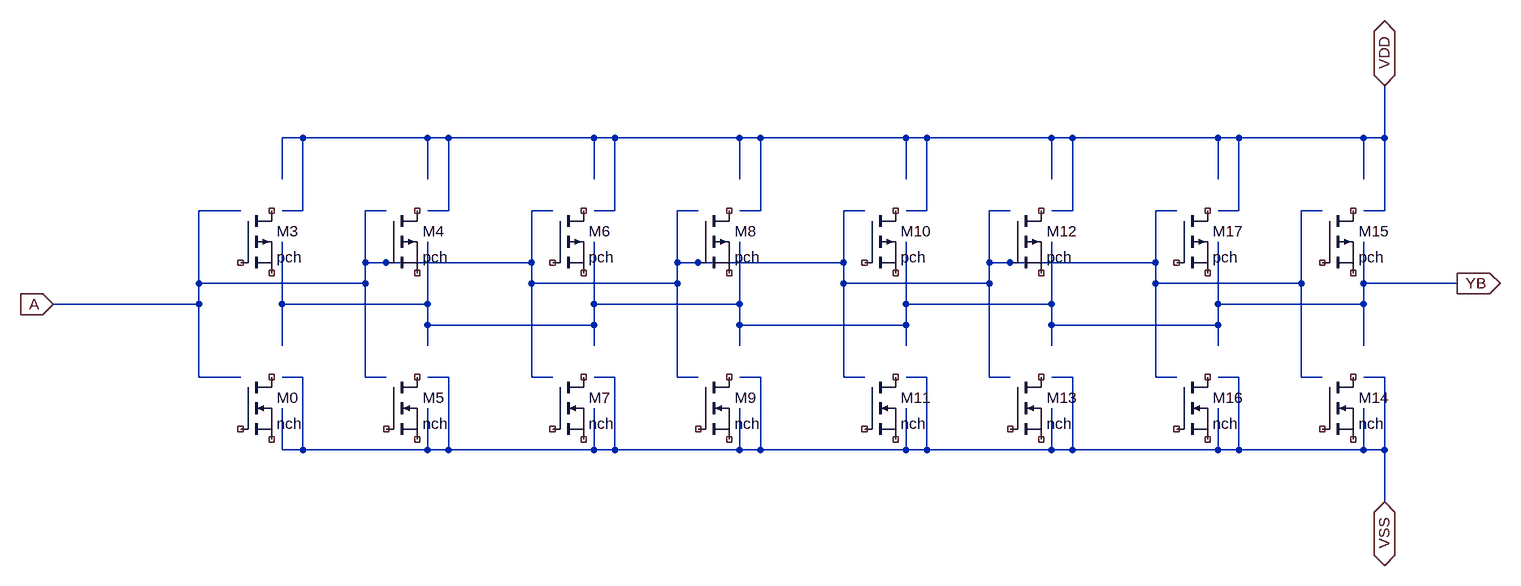
[diagram p0: schematic inv8.asc]
inv8.asc, the LTspice schematic file:
Version 4
SHEET 1 2336 832
WIRE 2112 400 2112 336
WIRE 1888 432 1888 336
WIRE 1888 464 1888 432
WIRE 1888 496 1888 464
WIRE 1632 464 1632 432
WIRE 2112 432 2112 400
WIRE 2112 496 2112 432
WIRE 1408 432 1632 432
WIRE 1408 432 1408 336
WIRE 1408 464 1408 432
WIRE 1408 496 1408 464
WIRE 1632 464 1888 464
WIRE 1152 464 1152 432
WIRE 1632 432 1632 336
WIRE 1888 432 2112 432
WIRE 1632 496 1632 464
WIRE 1152 432 1152 336
WIRE 928 432 928 336
WIRE 928 432 1152 432
WIRE 672 464 928 464
WIRE 672 496 672 464
WIRE 928 464 928 432
WIRE 928 496 928 464
WIRE 1152 496 1152 464
WIRE 448 432 448 336
WIRE 448 432 672 432
WIRE 672 432 672 336
WIRE 672 464 672 432
WIRE 2112 400 2256 400
WIRE 448 496 448 432
WIRE 1152 464 1408 464
WIRE 1792 544 1792 400
WIRE 1536 368 1536 288
WIRE 1792 368 1792 288
WIRE 1792 288 1824 288
WIRE 1792 400 1792 368
WIRE 1792 544 1824 544
WIRE 2016 400 2016 288
WIRE 2016 288 2048 288
WIRE 2016 544 2048 544
WIRE 2016 544 2016 400
WIRE 1536 368 1792 368
WIRE 1792 400 2016 400
WIRE 1312 544 1312 400
WIRE 1056 368 1056 288
WIRE 1312 368 1312 288
WIRE 1312 288 1344 288
WIRE 1312 400 1312 368
WIRE 1312 544 1344 544
WIRE 1536 400 1536 368
WIRE 1536 288 1568 288
WIRE 1536 544 1568 544
WIRE 1536 544 1536 400
WIRE 1056 368 1312 368
WIRE 832 400 1056 400
WIRE 832 544 832 400
WIRE 1056 400 1056 368
WIRE 1312 400 1536 400
WIRE 1056 288 1088 288
WIRE 1056 544 1088 544
WIRE 1056 544 1056 400
WIRE 320 432 320 400
WIRE 576 288 608 288
WIRE 576 544 608 544
WIRE 832 368 832 288
WIRE 576 368 576 288
WIRE 576 368 832 368
WIRE 832 288 864 288
WIRE 832 400 832 368
WIRE 832 544 864 544
WIRE 576 400 576 368
WIRE 320 400 576 400
WIRE 320 544 320 432
WIRE 576 544 576 400
WIRE 320 288 384 288
WIRE 320 544 384 544
WIRE 320 400 320 288
WIRE 96 432 320 432
WIRE 1920 656 2112 656
WIRE 1664 656 1888 656
WIRE 1440 656 1632 656
WIRE 1184 656 1408 656
WIRE 1888 656 1920 656
WIRE 1920 656 1920 544
WIRE 1888 544 1920 544
WIRE 1888 656 1888 592
WIRE 2112 656 2144 656
WIRE 2144 656 2144 544
WIRE 2112 544 2144 544
WIRE 2112 656 2112 592
WIRE 1408 656 1440 656
WIRE 1440 656 1440 544
WIRE 1408 544 1440 544
WIRE 1408 656 1408 592
WIRE 1632 656 1664 656
WIRE 1664 656 1664 544
WIRE 1632 544 1664 544
WIRE 1632 656 1632 592
WIRE 704 656 928 656
WIRE 960 656 1152 656
WIRE 928 656 960 656
WIRE 960 656 960 544
WIRE 928 544 960 544
WIRE 928 656 928 592
WIRE 1152 656 1184 656
WIRE 1184 656 1184 544
WIRE 1152 544 1184 544
WIRE 1152 656 1152 592
WIRE 480 656 672 656
WIRE 672 656 704 656
WIRE 704 656 704 544
WIRE 672 544 704 544
WIRE 672 656 672 592
WIRE 2144 656 2144 736
WIRE 448 656 480 656
WIRE 480 656 480 544
WIRE 448 544 480 544
WIRE 448 656 448 592
WIRE 1920 176 2112 176
WIRE 1664 176 1888 176
WIRE 1440 176 1632 176
WIRE 1184 176 1408 176
WIRE 1888 176 1920 176
WIRE 1920 288 1920 176
WIRE 1888 288 1920 288
WIRE 1888 240 1888 176
WIRE 2112 176 2144 176
WIRE 2144 288 2144 176
WIRE 2112 288 2144 288
WIRE 2112 240 2112 176
WIRE 1408 176 1440 176
WIRE 1440 288 1440 176
WIRE 1408 288 1440 288
WIRE 1408 240 1408 176
WIRE 1632 176 1664 176
WIRE 1664 288 1664 176
WIRE 1632 288 1664 288
WIRE 1632 240 1632 176
WIRE 928 176 960 176
WIRE 960 288 960 176
WIRE 928 288 960 288
WIRE 928 240 928 176
WIRE 1152 176 1184 176
WIRE 1184 288 1184 176
WIRE 1152 288 1184 288
WIRE 1152 240 1152 176
WIRE 960 176 1152 176
WIRE 480 176 672 176
WIRE 672 176 704 176
WIRE 704 176 928 176
WIRE 704 288 704 176
WIRE 672 288 704 288
WIRE 672 240 672 176
WIRE 2144 96 2144 176
WIRE 448 176 480 176
WIRE 480 288 480 176
WIRE 448 288 480 288
WIRE 448 240 448 176
SYMBOL PMOS 1824 288 R0
SYMATTR InstName M17
SYMATTR Value pch
SYMATTR Value2 w=6u l=1u
SYMBOL PMOS 2048 288 R0
SYMATTR InstName M15
SYMATTR Value pch
SYMATTR Value2 w=6u l=1u
SYMBOL PMOS 1568 288 R0
SYMATTR InstName M12
SYMATTR Value pch
SYMATTR Value2 w=6u l=1u
SYMBOL PMOS 1344 288 R0
SYMATTR InstName M10
SYMATTR Value pch
SYMATTR Value2 w=6u l=1u
SYMBOL PMOS 1088 288 R0
SYMATTR InstName M8
SYMATTR Value pch
SYMATTR Value2 w=6u l=1u
SYMBOL PMOS 864 288 R0
SYMATTR InstName M6
SYMATTR Value pch
SYMATTR Value2 w=6u l=1u
SYMBOL PMOS 608 288 R0
SYMATTR InstName M4
SYMATTR Value pch
SYMATTR Value2 w=6u l=1u
SYMBOL PMOS 384 288 R0
SYMATTR InstName M3
SYMATTR Value pch
SYMATTR Value2 w=6u l=1u
SYMBOL NMOS 1824 544 R0
SYMATTR InstName M16
SYMATTR Value nch
SYMATTR Value2 w=2u l=1u
SYMBOL NMOS 2048 544 R0
SYMATTR InstName M14
SYMATTR Value nch
SYMATTR Value2 w=2u l=1u
SYMBOL NMOS 1568 544 R0
SYMATTR InstName M13
SYMATTR Value nch
SYMATTR Value2 w=2u l=1u
SYMBOL NMOS 1344 544 R0
SYMATTR InstName M11
SYMATTR Value nch
SYMATTR Value2 w=2u l=1u
SYMBOL NMOS 1088 544 R0
SYMATTR InstName M9
SYMATTR Value nch
SYMATTR Value2 w=2u l=1u
SYMBOL NMOS 864 544 R0
SYMATTR InstName M7
SYMATTR Value nch
SYMATTR Value2 w=2u l=1u
SYMBOL NMOS 608 544 R0
SYMATTR InstName M5
SYMATTR Value nch
SYMATTR Value2 w=2u l=1u
SYMBOL NMOS 384 544 R0
SYMATTR InstName M0
SYMATTR Value nch
SYMATTR Value2 w=2u l=1u
FLAG 2256 400 YB
IOPIN 2256 400 Out
FLAG 2144 736 VSS
IOPIN 2144 736 BiDir
FLAG 2144 96 VDD
IOPIN 2144 96 BiDir
FLAG 96 432 A
IOPIN 96 432 In

The netlist it stands for:
* inv8.asc
* M17: pch w=6u l=1u (symbol PMOS not certain, pin order unknown); nets seen at it: 
* M15: pch w=6u l=1u (symbol PMOS not certain, pin order unknown); nets seen at it: 
* M12: pch w=6u l=1u (symbol PMOS not certain, pin order unknown); nets seen at it: A
* M10: pch w=6u l=1u (symbol PMOS not certain, pin order unknown); nets seen at it: 
* M8: pch w=6u l=1u (symbol PMOS not certain, pin order unknown); nets seen at it: A
* M6: pch w=6u l=1u (symbol PMOS not certain, pin order unknown); nets seen at it: 
* M4: pch w=6u l=1u (symbol PMOS not certain, pin order unknown); nets seen at it: A
* M3: pch w=6u l=1u (symbol PMOS not certain, pin order unknown); nets seen at it: 
* M16: nch w=2u l=1u (symbol NMOS not certain, pin order unknown); nets seen at it: 
* M14: nch w=2u l=1u (symbol NMOS not certain, pin order unknown); nets seen at it: 
* M13: nch w=2u l=1u (symbol NMOS not certain, pin order unknown); nets seen at it: 
* M11: nch w=2u l=1u (symbol NMOS not certain, pin order unknown); nets seen at it: 
* M9: nch w=2u l=1u (symbol NMOS not certain, pin order unknown); nets seen at it: 
* M7: nch w=2u l=1u (symbol NMOS not certain, pin order unknown); nets seen at it: 
* M5: nch w=2u l=1u (symbol NMOS not certain, pin order unknown); nets seen at it: 
* M0: nch w=2u l=1u (symbol NMOS not certain, pin order unknown); nets seen at it: 
.backanno
.end